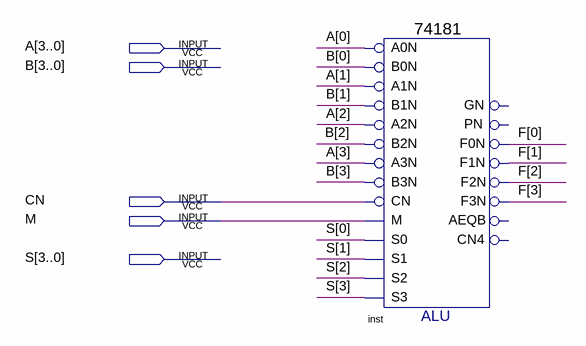
[diagram p0: schematic sheet]
// Quartus schematic ALU_4.bdf as structural Verilog: 1 symbols, 5 pins
module ALU_4 (
  input  [3:0] A,
  input  [3:0] B,
  input  CN,
  input  M,
  input  [3:0] S
);

  wire [3:0] F;

  \74181  inst (
    .B0N(B[0]), .A0N(A[0]), .A1N(A[1]), .B1N(B[1]), .A3N(A[3]), .B2N(B[2]), .A2N(A[2]), .M(M), .CN(CN),
    .B3N(B[3]), .S2(S[2]), .S1(S[1]), .S0(S[0]), .S3(S[3]), .F3N(F[3]), .F1N(F[1]), .F0N(F[0]), .F2N(F[2]));  // open: PN, GN, AEQB, CN4
endmodule
